# Altium schematic sheet MCU.SchDoc
size A; SheetNumber: 2; SheetTotal: 8
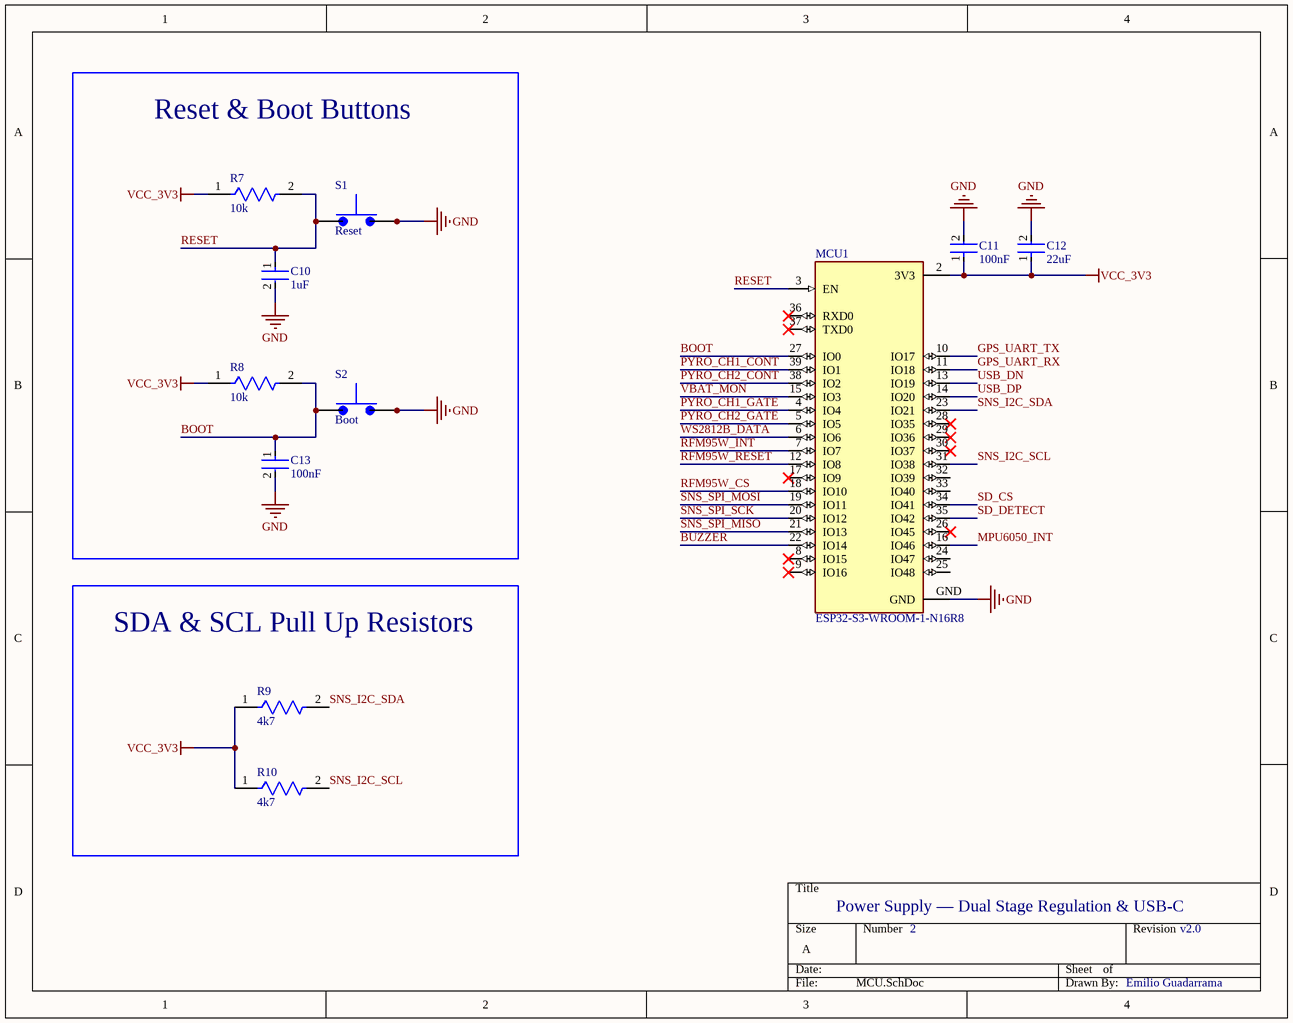
[diagram p0: MCU.SchDoc]

## Parts
C10  1uF  [FP-C0805C-DN-MFG]
C11  100nF  [FP-C0805C-DN-MFG]
C12  22uF  [FP-C0805C-DN-MFG]
C13  100nF  [FP-C0805C-DN-MFG]
MCU1  ESP32-S3-WROOM-1-N16R8  [XCVR_ESP32-S3-WROOM-1-N16R2]
R7  10k  [FP-MCT0603-IPC_A]
R8  10k  [FP-MCT0603-IPC_A]
R9  4k7  [FP-MCT0603-IPC_A]
R10  4k7  [FP-MCT0603-IPC_A]
S1  Reset  [SW_SKRPABE010]
S2  Boot  [SW_SKRPABE010]

## Blocks framed on the sheet
Reset & Boot Buttons: C10 C13 R7 R8 S1 S2
SDA & SCL Pull Up Resistors: R9 R10

## Nets
GND: C10.2 C11.2 C12.2 C13.2 MCU1.GND S1.3 S1.4 S2.3 S2.4
VCC_3V3: C11.1 C12.1 MCU1.2(3V3) R7.1 R8.1 R9.1 R10.1
BOOT: C13.1 MCU1.27(IO0) R8.2 S2.1 S2.2
BUZZER: MCU1.22(IO14)
GPS_UART_RX: MCU1.11(IO18)
GPS_UART_TX: MCU1.10(IO17)
MPU6050_INT: MCU1.16(IO46)
PYRO_CH1_CONT: MCU1.39(IO1)
PYRO_CH1_GATE: MCU1.4(IO4)
PYRO_CH2_CONT: MCU1.38(IO2)
PYRO_CH2_GATE: MCU1.5(IO5)
RESET: C10.1 MCU1.3(EN) R7.2 S1.1 S1.2
RFM95W_CS: MCU1.18(IO10)
RFM95W_INT: MCU1.7(IO7)
RFM95W_RESET: MCU1.12(IO8)
SD_CS: MCU1.34(IO41)
SD_DETECT: MCU1.35(IO42)
SNS_I2C_SCL: MCU1.31(IO38) R10.2
SNS_I2C_SDA: MCU1.23(IO21) R9.2
SNS_SPI_MISO: MCU1.21(IO13)
SNS_SPI_MOSI: MCU1.19(IO11)
SNS_SPI_SCK: MCU1.20(IO12)
USB_DN: MCU1.13(IO19)
USB_DP: MCU1.14(IO20)
VBAT_MON: MCU1.15(IO3)
WS2812B_DATA: MCU1.6(IO6)

Not connected (* = marked no-connect by the designer): MCU1 8(IO15)* 9(IO16)* 17(IO9)* 24(IO47) 25(IO48) 26(IO45)* 28(IO35)* 29(IO36)* 30(IO37)* 32(IO39) 33(IO40) 36(RXD0)* 37(TXD0)*

## Notes on the sheet
- Power Supply — Dual Stage Regulation & USB-C
- 2
- v2.0
- Emilio Guadarrama

## Library data of the parts
C10-C13 = CMP-2007-00279-2: CAP CER 0.1UF 50V X7R 0805; Manufacturer Part Number: C0805C104K5RACTU; Manufacturer: KEMET; Value: 0.10 μF; Tolerance: 0.1; Temperature Coefficient: 30ppm/°C; Material: Ceramic; Device Class L2: Capacitors; Temperature Range Low: -55°C; Voltage Rating: 50 V; Digikey Description: CAP CER 0.1UF 50V X7R 0805; Category: Cap; ComponentLink2Description: Datasheet; Octopart: https://octopart.com/c0805c104k5ractu-kemet-143926; RoHS: TRUE; ComponentLink2URL: https://content.kemet.com/datasheets/KEM_C1003_C0G_SMD.pdf; Temperature Characteristic: X7R; Temperature: -55°C to +125°C; Height: 0.88mm; Temperature Range High: +125°C; Device Class L1: Passive Components; Automotive: No; Lead Free: Yes; Ipc Land Pattern Name: CAPC200125X78; Device Class L3: Ceramic Capacitors; Mouser Description: Cap Ceramic 0.1uF 50V X7R 10% SMD 2.0 x 1.2 mm 125 C Paper T/R; Capacitance: 0.10 μF; Package: C0805C-DN
MCU1 = ESP32-S3-WROOM-1-N16R2: Bluetooth, WiFi 802.11b/g/n, Bluetooth v5.0 Transceiver Module 2.4GHz PCB Trace Surface Mount; MF: Espressif Systems; MP: ESP32S3WROOM1N16R2; SnapEDA_Link: https://www.snapeda.com/parts/ESP32S3WROOM1N16R2/Espressif+Systems/view-part/?ref=snap; Package: NON STANDARD Espressif Systems; Value: *; Check_prices: https://www.snapeda.com/parts/ESP32S3WROOM1N16R2/Espressif+Systems/view-part/?ref=eda
R7-R10 = CMP-02407-011165-1: RES SMD 100 OHM 1% 1/8W 0603; Temperature Coefficient: 25ppm/°C; Resistance: 20kR; Power Rating: 125mW; Tolerance: 0.1%; Voltage Rating: 75V; Length: 1.55mm; Case Code (Imperial): 0603; Case/Package: 0603; Construction: Rectangular; Package Quantity: 1000; Number of Terminations: 2; Termination: SMD/SMT; Resistor Type: Thin Film; Features: Automotive AEC-Q200; Series: MCT 0603 - Precision; Max Operating Temperature: 155°C; Depth: 0.85mm; Max Power Dissipation: 125mW; Min Operating Temperature: -55°C; Width: 0.033inch; Case Code (Metric): 1608; Packaging: Tape and Reel; Weight: 6.7E-05oz; Military Standard: Not; Height: 0.022inch
S1 S2 = SKRPABE010: Switch Tactile N.O. SPST Button J-Bend 0.05A 16VDC 1.57N SMD Automotive T/R; MF: ALPS; SnapEDA_Link: https://www.snapeda.com/parts/SKRPABE010/ALPS/view-part/?ref=snap; Package: None; Value: *; MP: SKRPABE010; Check_prices: https://www.snapeda.com/parts/SKRPABE010/ALPS/view-part/?ref=eda